# EAGLE schematic connector_board (EAGLE 6.5.0)
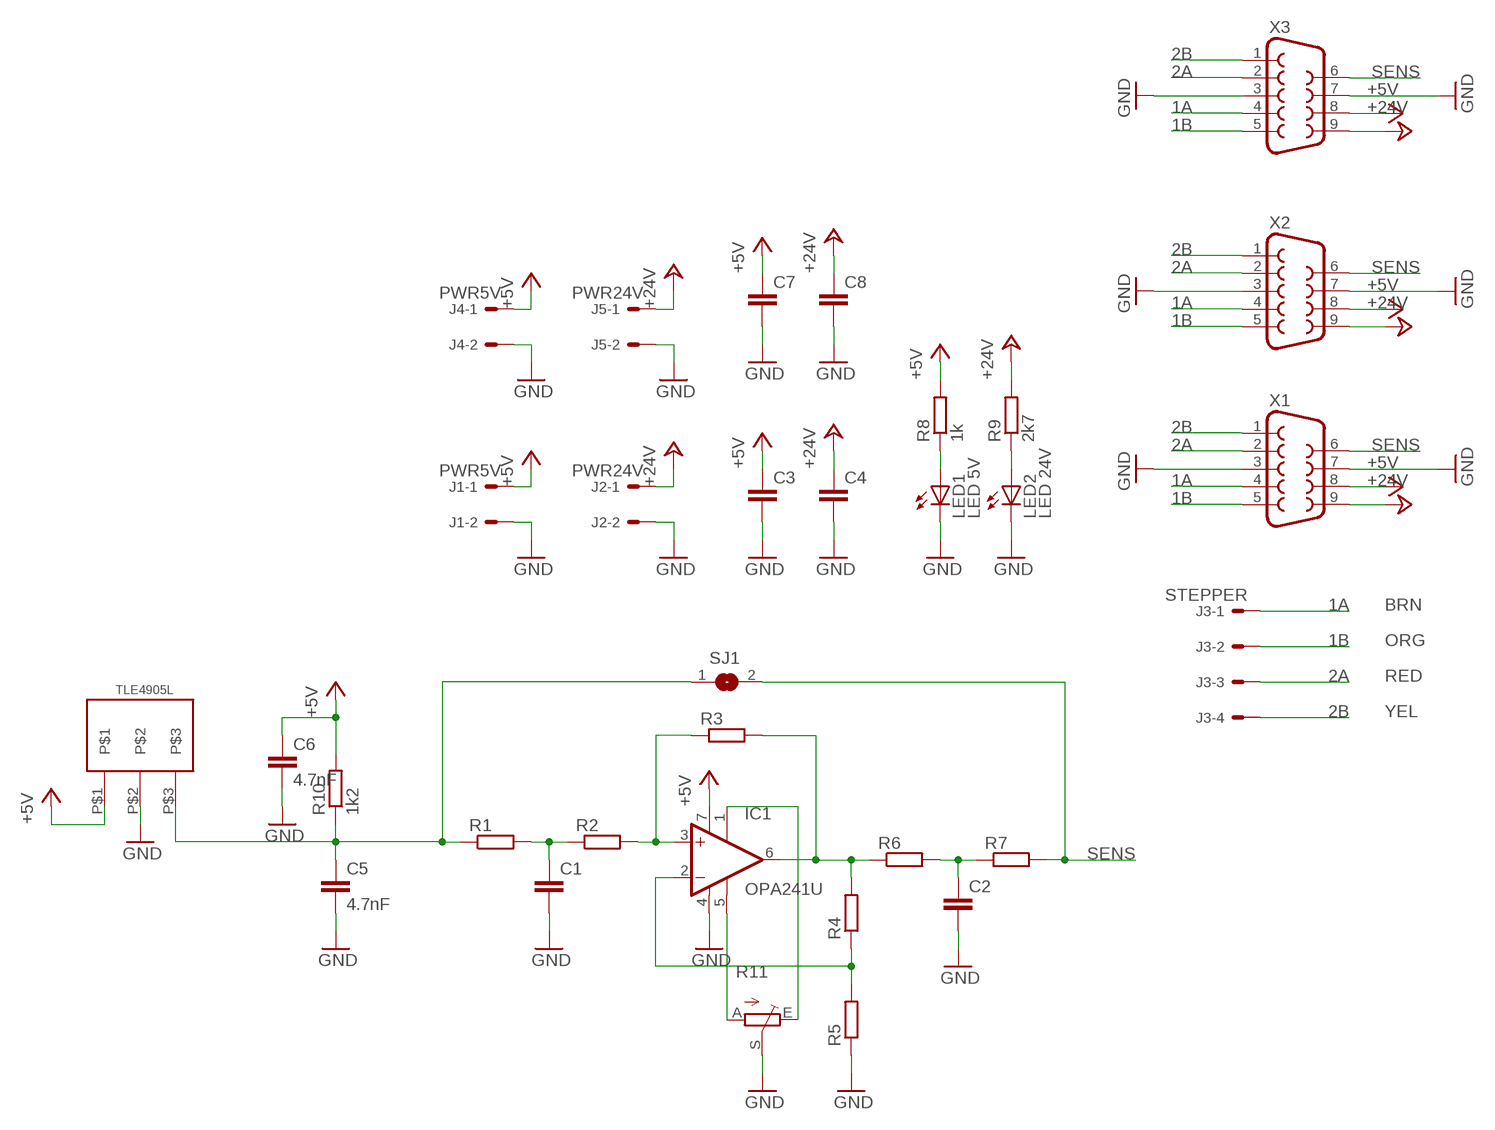
[diagram p0: schematic, sheet 1]

## Parts
C1  C-EUC0805K  [C0805K]
C2  C-EUC0805K  [C0805K]
C3  C-EUC0805K  [C0805K]
C4  C-EUC0805K  [C0805K]
C5  4.7nF  C-EUC0805K  [C0805K]
C6  4.7nF  C-EUC0805K  [C0805K]
C7  C-EUC0805K  [C0805K]
C8  C-EUC0805K  [C0805K]
IC1  OPA241U  [SO08]
J1  PWR5V  22-05-7028-02  [7395-02]
J2  PWR24V  22-05-7028-02  [7395-02]
J3  STEPPER  22-05-7048-04  [7395-04]
J4  PWR5V  22-05-7028-02  [7395-02]
J5  PWR24V  22-05-7028-02  [7395-02]
LED1  LED 5V  LEDCHIPLED_0805  [CHIPLED_0805]
LED2  LED 24V  LEDCHIPLED_0805  [CHIPLED_0805]
R1  R-EU_M0805  [M0805]
R2  R-EU_M0805  [M0805]
R3  R-EU_M0805  [M0805]
R4  R-EU_M0805  [M0805]
R5  R-EU_M0805  [M0805]
R6  R-EU_M0805  [M0805]
R7  R-EU_M0805  [M0805]
R8  1k  R-EU_M0805  [M0805]
R9  2k7  R-EU_M0805  [M0805]
R10  1k2  R-EU_M0805  [M0805]
R11  TRIM_EU-B64Y  [B64Y]
SJ1  SJ  [SJ]
U$1  TLE4905L  [TLE4905L]
X1  F09HP  [F09HP]
X2  F09HP  [F09HP]
X3  F09HP  [F09HP]

## Nets
1A: J3.1 X1.4 X2.4 X3.4
1B: J3.2 X1.5 X2.5 X3.5
2A: J3.3 X1.2 X2.2 X3.2
2B: J3.4 X1.1 X2.1 X3.1
+5V: C3.1 C6.1 C7.1 IC1.7(V+) J1.1 J4.1 R8.2 R10.2 U$1.P$1 X1.8 X2.8 X3.8
+24V: C4.1 C8.1 J2.1 J5.1 R9.2 X1.9 X2.9 X3.9
GND: C1.2 C2.2 C3.2 C4.2 C5.2 C6.2 C7.2 C8.2 IC1.4(V-) J1.2 J2.2 J4.2 J5.2 LED1.C LED2.C R5.1 R11.S U$1.P$2 X1.3 X1.7 X2.3 X2.7 X3.3 X3.7
N$1: IC1.3(+IN) R2.2 R3.1
N$2: C1.1 R1.2 R2.1
N$3: IC1.6(OUT) R3.2 R4.2 R6.1
N$4: IC1.2(-IN) R4.1 R5.2
N$5: C2.1 R6.2 R7.1
N$6: C5.1 R1.1 R10.1 SJ1.1 U$1.P$3
N$7: IC1.5(TRIM2) R11.A
N$8: LED1.A R8.1
N$9: LED2.A R9.1
N$10: IC1.1(TRIM1) R11.E
SENS: R7.2 SJ1.2 X1.6 X2.6 X3.6

## Notes on the sheet
- BRN
- ORG
- RED
- YEL

## Library data of the parts
C1-C8 = rcl:C-EU: CAPACITOR, European symbol
IC1 = burr-brown:OPA241: Operational Amplifiers Single-Supply, MicroPower
J1 J2 J4 J5 = con-molex:22-?-02: CONNECTOR wire to board 2.54 mm (.1 inch) pitch header
J3 = con-molex:22-?-04: CONNECTOR wire to board 2.54 mm (.1 inch) pitch header
LED1 LED2 = led:LED: LED OSRAM: - CHIPLED LG R971, LG N971, LY N971, LG Q971, LY Q971, LO R971, LY R971 LH N974, LH R974 LS Q976, LO Q976, LY Q976 LO Q996 - Hyper CHIPLED LW Q18S LB Q993, LB Q99A, LB R99A - SideLED LS A670, LO A670, LY A670, LG A670, LP A670 LB A673, LV A673, LT A673, LW A673 LH A674 LY A675 LS A676, LA A676, LO A676, LY A676, LW A676 LS A679, LY A679, LG A679 - Hyper Micro SIDELED® LS Y876, LA Y876, LO Y876, LY Y876 LT Y87S - SmartLED LW L88C, LW L88S LB L89C, LB L89S, LG L890 LS L89K, LO L89K, LY L89K LS L896, LA L896, LO L896, LY L896 - TOPLED LS T670, LO T670, LY T670, LG T670, LP T670 LSG T670, LSP T670, LSY T670, LOP T670, LYG T670 LG T671, LOG T671, LSG T671 LB T673, LV T673, LT T673, LW T673 LH T674 LS T676, LA T676, LO T676, LY T676, LB T676, LH T676, LSB T676, LW T676 LB T67C, LV T67C, LT T67C, LS T67K, LO T67K, LY T67K, LW E67C LS E67B, LA E67B, LO E67B, LY E67B, LB E67C, LV E67C, LT E67C LW T67C LS T679, LY T679, LG T679 LS T770, LO T770, LY T770, LG T770, LP T770 LB T773, LV T773, LT T773, LW T773 LH T774 LS E675, LA E675, LY E675, LS T675 LS T776, LA T776, LO T776, LY T776, LB T776 LHGB T686 LT T68C, LB T68C - Hyper Mini TOPLED® LB M676 - Mini TOPLED Santana® LG M470 LS M47K, LO M47K, LY M47K Source: http://www.osram.convergy.de LUXEON: - LUMILED® LXK2-PW12-R00, LXK2-PW12-S00, LXK2-PW14-U00, LXK2-PW14-V00 LXK2-PM12-R00, LXK2-PM12-S00, LXK2-PM14-U00 LXK2-PE12-Q00, LXK2-PE12-R00, LXK2-PE12-S00, LXK2-PE14-T00, LXK2-PE14-U00 LXK2-PB12-K00, LXK2-PB12-L00, LXK2-PB12-M00, LXK2-PB14-N00, LXK2-PB14-P00, LXK2-PB14-Q00 LXK2-PR12-L00, LXK2-PR12-M00, LXK2-PR14-Q00, LXK2-PR14-R00 LXK2-PD12-Q00, LXK2-PD12-R00, LXK2-PD12-S00 LXK2-PH12-R00, LXK2-PH12-S00 LXK2-PL12-P00, LXK2-PL12-Q00, LXK2-PL12-R00 Source: www.luxeon.com KINGBRIGHT: KA-3528ASYC Source: www.kingbright.com
R1-R10 = rcl:R-EU_: RESISTOR, European symbol
R11 = pot:TRIM_EU-: POTENTIOMETER
SJ1 = jumper:SJ: SMD solder JUMPER
U$1 = Kim:TLE4905L
X1-X3 = con-subd:F09: SUB-D